# EAGLE design untitled (EAGLE 9.5.1)
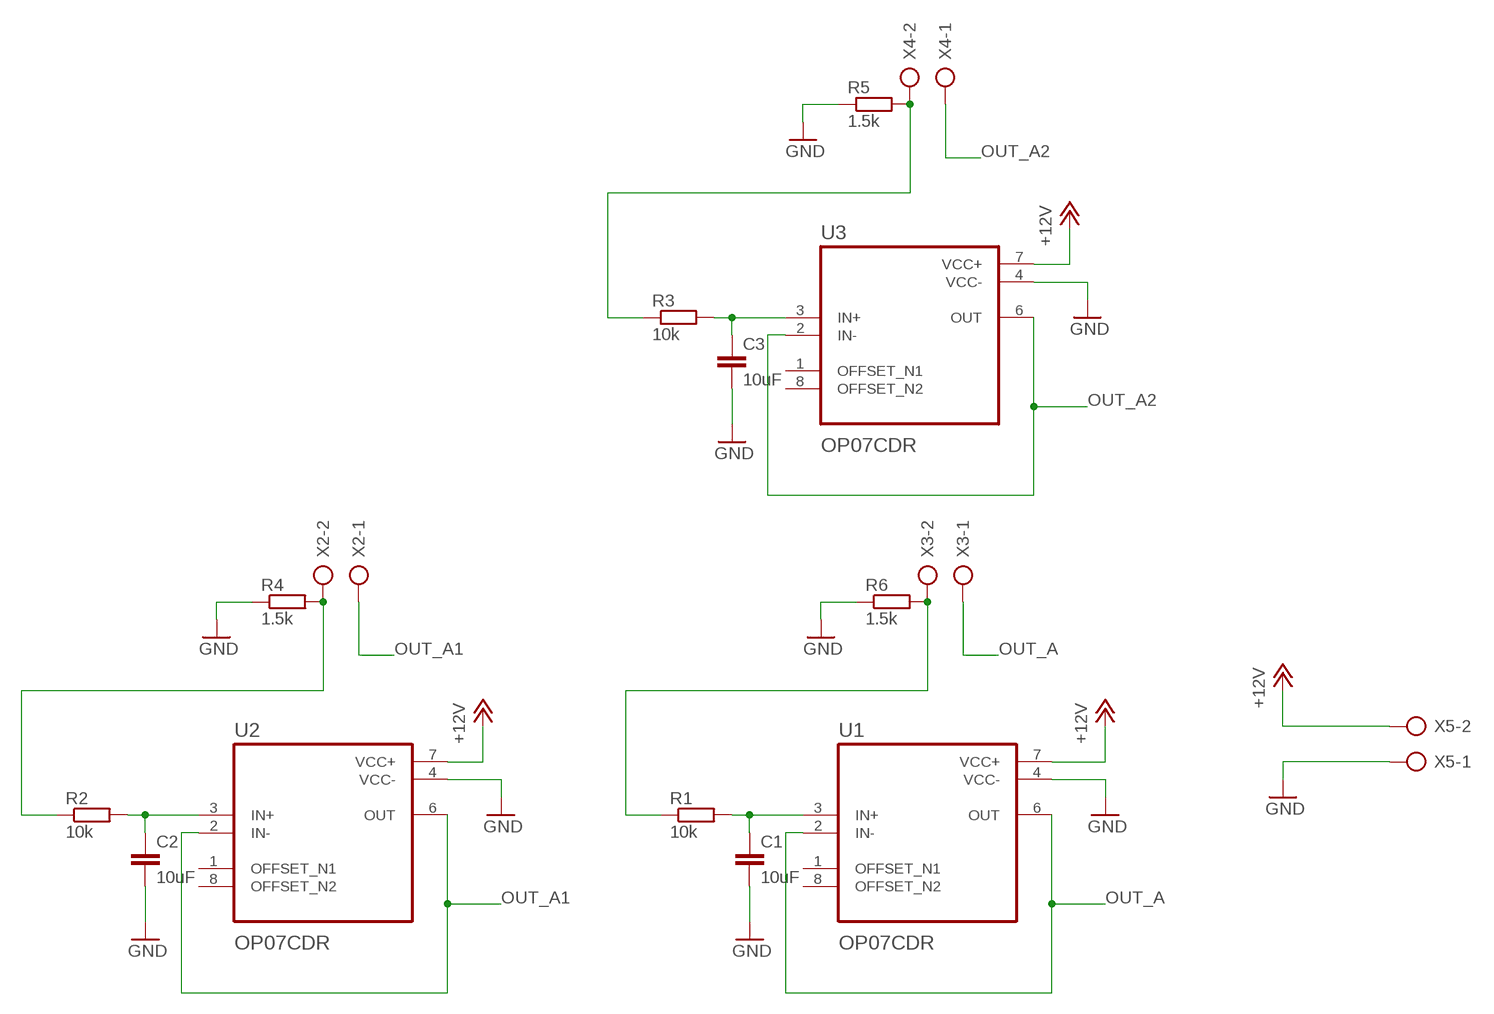
[diagram p0: schematic, sheet 1]

## Parts
C1  10uF  C-EUC0805  [C0805]
C2  10uF  C-EUC0805  [C0805]
C3  10uF  C-EUC0805  [C0805]
R1  10k  R-EU_M0805  [M0805]
R2  10k  R-EU_M0805  [M0805]
R3  10k  R-EU_M0805  [M0805]
R4  1.5k  R-EU_M0805  [M0805]
R5  1.5k  R-EU_M0805  [M0805]
R6  1.5k  R-EU_M0805  [M0805]
U1  OP07CDR  [SOIC127P599X175-8N]
U2  OP07CDR  [SOIC127P599X175-8N]
U3  OP07CDR  [SOIC127P599X175-8N]
X2  AK500/2  [AK500/2]
X3  AK500/2  [AK500/2]
X4  AK500/2  [AK500/2]
X5  AK500/2  [AK500/2]

## Nets
+12V: U1.7(VCC+) U2.7(VCC+) U3.7(VCC+) X5.2
GND: C1.2 C2.2 C3.2 R4.1 R5.1 R6.1 U1.4(VCC-) U2.4(VCC-) U3.4(VCC-) X5.1
N$1: R1.1 R6.2 X3.2
N$2: C1.1 R1.2 U1.3(IN+)
N$3: R2.1 R4.2 X2.2
N$4: C2.1 R2.2 U2.3(IN+)
N$5: R3.1 R5.2 X4.2
N$6: C3.1 R3.2 U3.3(IN+)
OUT_A: U1.2(IN-) U1.6(OUT) X3.1
OUT_A1: U2.2(IN-) U2.6(OUT) X2.1
OUT_A2: U3.2(IN-) U3.6(OUT) X4.1
Unconnected: U1.1(OFFSET_N1) U1.8(OFFSET_N2) U2.1(OFFSET_N1) U2.8(OFFSET_N2) U3.1(OFFSET_N1) U3.8(OFFSET_N2)

## Library data of the parts
C1-C3 = rcl:C-EU: CAPACITOR, European symbol; SPICEPREFIX: C
R1-R6 = rcl:R-EU_: RESISTOR, European symbol; SPICEPREFIX: R
U1-U3 = OP07CDR:OP07CDR: Check prices <https://pricing.snapeda.com/parts/OP07CDR/Texas%20Instruments/view-part?ref=eda>; AVAILABILITY: Warning; DESCRIPTION: Low-Offset voltage (0.25mV) single operational amplifier 8-SOIC 0 to 70; MF: Texas Instruments; MP: OP07CDR; PACKAGE: SOIC-8 Texas Instruments; PRICE: None; PURCHASE-URL: https://pricing.snapeda.com/search/part/OP07CDR/?ref=eda
X2-X5 = con-ptr500:AK500/2: CONNECTOR; OC_FARNELL: unknown; OC_NEWARK: unknown

## Board
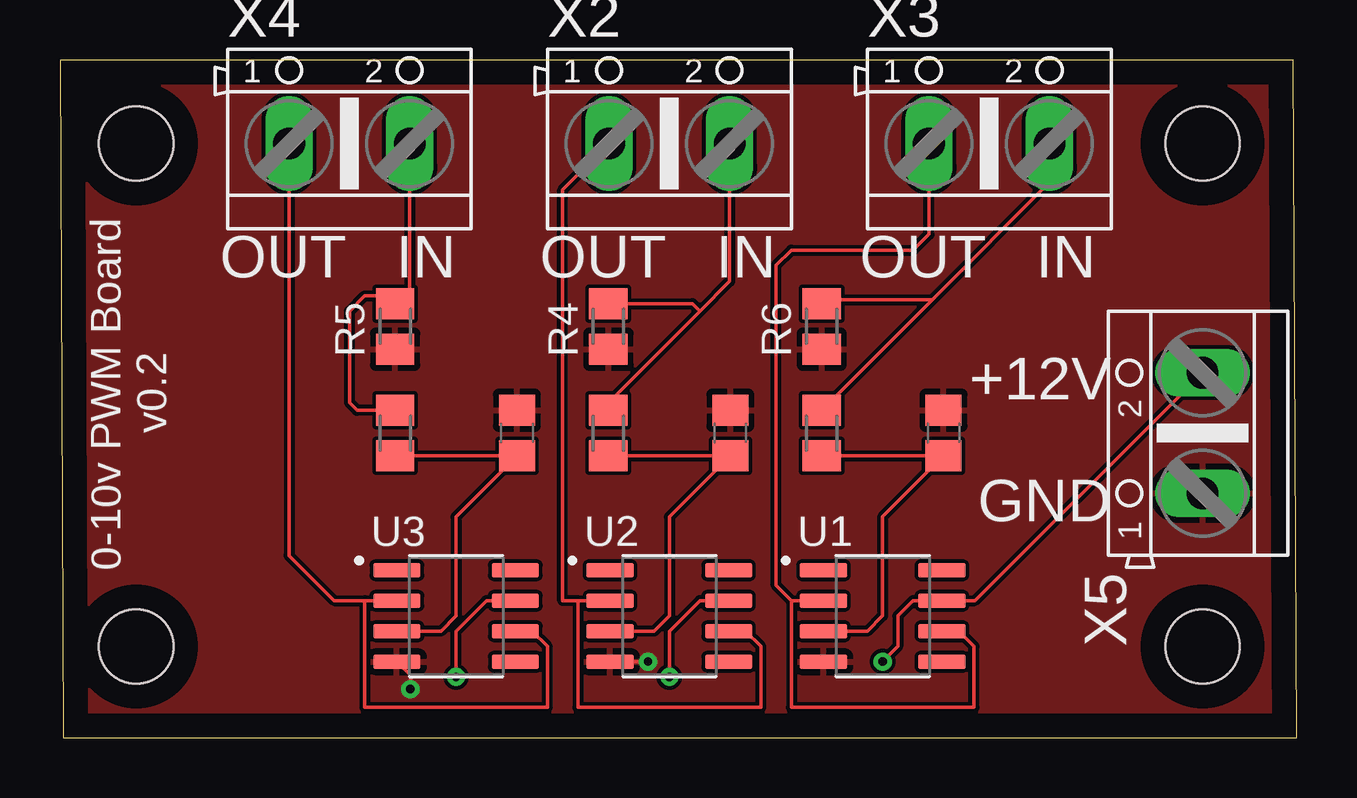
[diagram p1: board, top side]
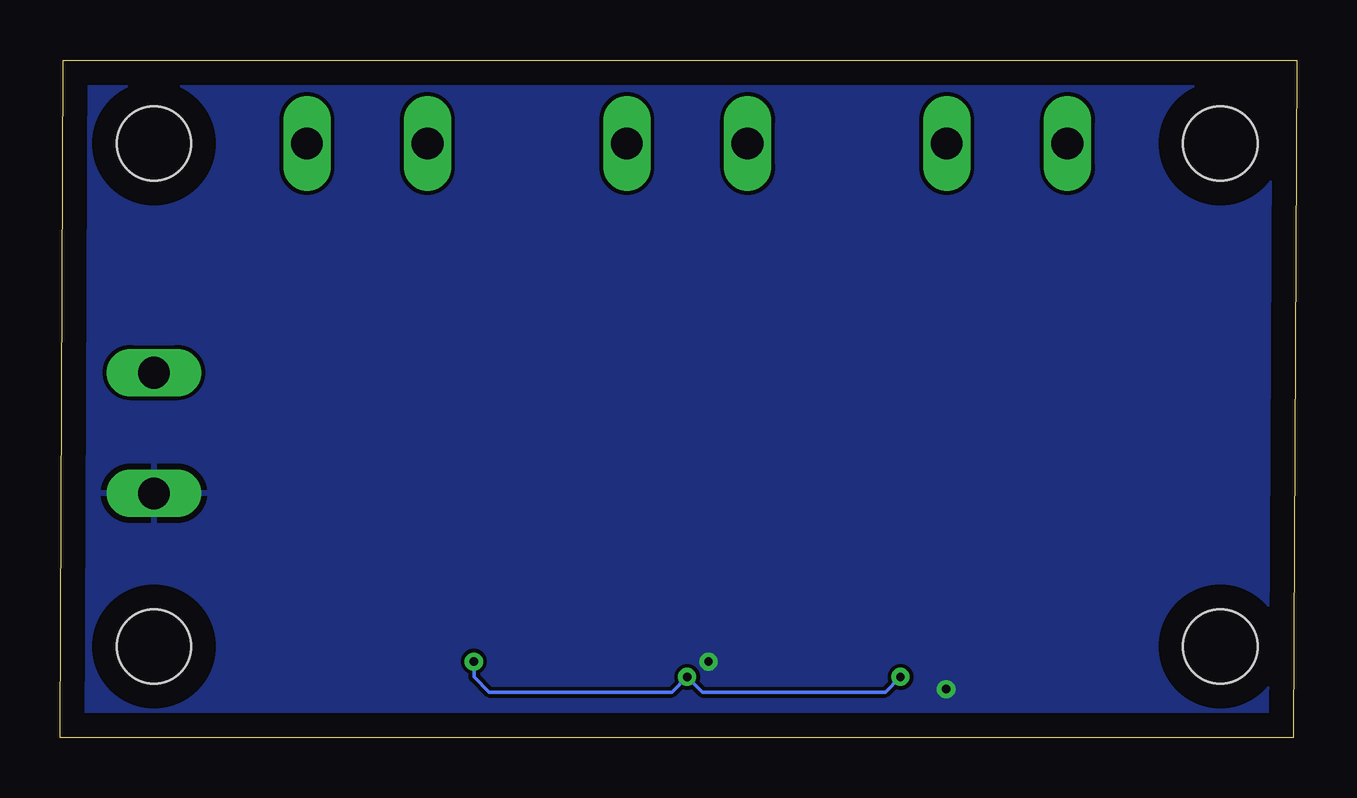
[diagram p2: board, bottom side, seen from below]

Size 51.54 x 28.24 mm. Coordinates in mm from the lower left corner, seen from the top.
Outline: 0.13,0 51.54,0 51.41,28.24 0,28.24 0.13,0
Copper layers (1*16): Top 0.035mm / dielectric 1.5mm / Bottom 0.035mm
Design rules "default": minimum track width 6mil, minimum drill 0.35mm, track to track 6mil, track to pad 6mil, pad to pad 6mil, via to via 6mil, smd to smd 6mil, copper to edge 40mil, drill to drill 6mil, minimum pad ring 10mil, minimum via ring 8mil, stop-mask expansion 4mil, vias tented up to drill 0mil, thermal gap 10mil
Holes 3.1 mm at 3.18,24.77 47.62,24.77 3.18,3.81 47.62,3.81

### Footprints (pad centres in the part's own frame; a part is rotated, then mirrored left to right if it is on the bottom)
C0805 = smd 1.3 x 1.5: 1 -0.95,0; 2 0.95,0
M0805 = smd 1.3 x 1.6: 1 -0.95,0; 2 0.95,0
SOIC127P599X175-8N = smd 1.97 x 0.6: 1 -2.47,1.905; 2 -2.47,0.635; 3 -2.47,-0.635; 4 -2.47,-1.905; 5 2.47,-1.905; 6 2.47,-0.635; 7 2.47,0.635; 8 2.47,1.905
AK500/2 = drill 1.321 long: 1 -2.515,0; 2 2.515,0

### Placement (x,y rotation side)
C1  36.83,12.7 90 top
C2  27.94,12.7 90 top
C3  19.05,12.7 90 top
R1  31.75,12.7 270 top
R2  22.86,12.7 270 top
R3  13.97,12.7 270 top
R4  22.86,17.14 90 top
R5  13.97,17.14 90 top
R6  31.75,17.14 90 top
U1  34.29,5.08 0 top
U2  25.4,5.08 0 top
U3  16.51,5.08 0 top
X2  25.4,24.77 0 top
X3  38.73,24.77 0 top
X4  12.07,24.77 0 top
X5  47.62,12.7 90 top

### Tracks (layer width: path | path; a pad name or v marks a point on that pad's centre or on a via)
+12V  (via drill 0.35)
  Top 0.152: v34.29,3.17 34.92,3.81 34.92,5.08 35.56,5.71 U1.7 38.12,5.71 X5.2 | U3.7 17.78,5.71 16.51,4.44 v16.51,2.54 | U2.7 26.67,5.71 25.4,4.44 v25.4,2.54
  Bottom 0.152: v34.29,3.17 34.29,2.54 33.66,1.9 26.04,1.9 v25.4,2.54 24.77,1.9 17.14,1.9 v16.51,2.54
GND  (via drill 0.35)
  Top 0.152: U3.4 14.61,2.61 v14.61,2.03 14.61,1.9 | U2.4 v24.51,3.17
  Bottom 0.152: v14.61,2.03 14.61,1.9
  pour Top: 0,27.94 0,0 51.44,0 51.44,27.94
  pour Bottom: 0,27.94 0,0 51.44,0 51.44,27.94
N$1
  Top 0.152: X3.2 41.25,23.15 36.36,18.26 | 36.36,18.26 R1.1 | R6.2 31.91,18.26 36.36,18.26
N$2
  Top 0.152: R1.2 C1.1 34.29,9.21 34.29,5.08 33.66,4.44 U1.3
N$3
  Top 0.152: X2.2 27.91,19.02 26.67,17.78 | R2.1 22.86,13.97 26.67,17.78 | R4.2 26.36,18.09 26.67,17.78
N$4
  Top 0.152: R2.2 C2.1 25.4,9.21 25.4,5.08 24.77,4.44 U2.3
N$5
  Top 0.152: X4.2 14.58,18.7 14.13,18.26 | 14.13,18.26 R5.2 | R3.1 12.38,13.65 12.07,13.97 12.07,17.78 12.7,18.41 13.97,18.41 14.13,18.26
N$6
  Top 0.152: R3.2 C3.1 16.51,9.21 16.51,5.08 15.88,4.44 U3.3
OUT_A
  Top 0.152: 30.48,5.71 U1.2 | 30.48,5.71 30.48,1.27 38.1,1.27 38.1,3.81 37.47,4.44 U1.6 | X3.1 36.22,20.98 35.56,20.32 30.48,20.32 29.84,19.69 29.84,6.35 30.48,5.71
OUT_A1
  Top 0.152: 21.59,5.71 U2.2 | 21.59,5.71 21.59,1.27 29.21,1.27 29.21,3.81 28.57,4.44 U2.6 | 21.59,5.71 20.96,5.71 20.96,22.84 X2.1
OUT_A2
  Top 0.152: U3.6 19.69,4.44 20.32,3.81 20.32,1.27 12.7,1.27 12.7,5.71 U3.2 11.43,5.71 9.55,7.59 X4.1

### Text on the board
tNames: OUT IN | OUT IN | OUT IN | +12V | v0.2 | GND | 0-10v PWM Board